# EAGLE design LED_Ansteuerung_extension (EAGLE 5.09)
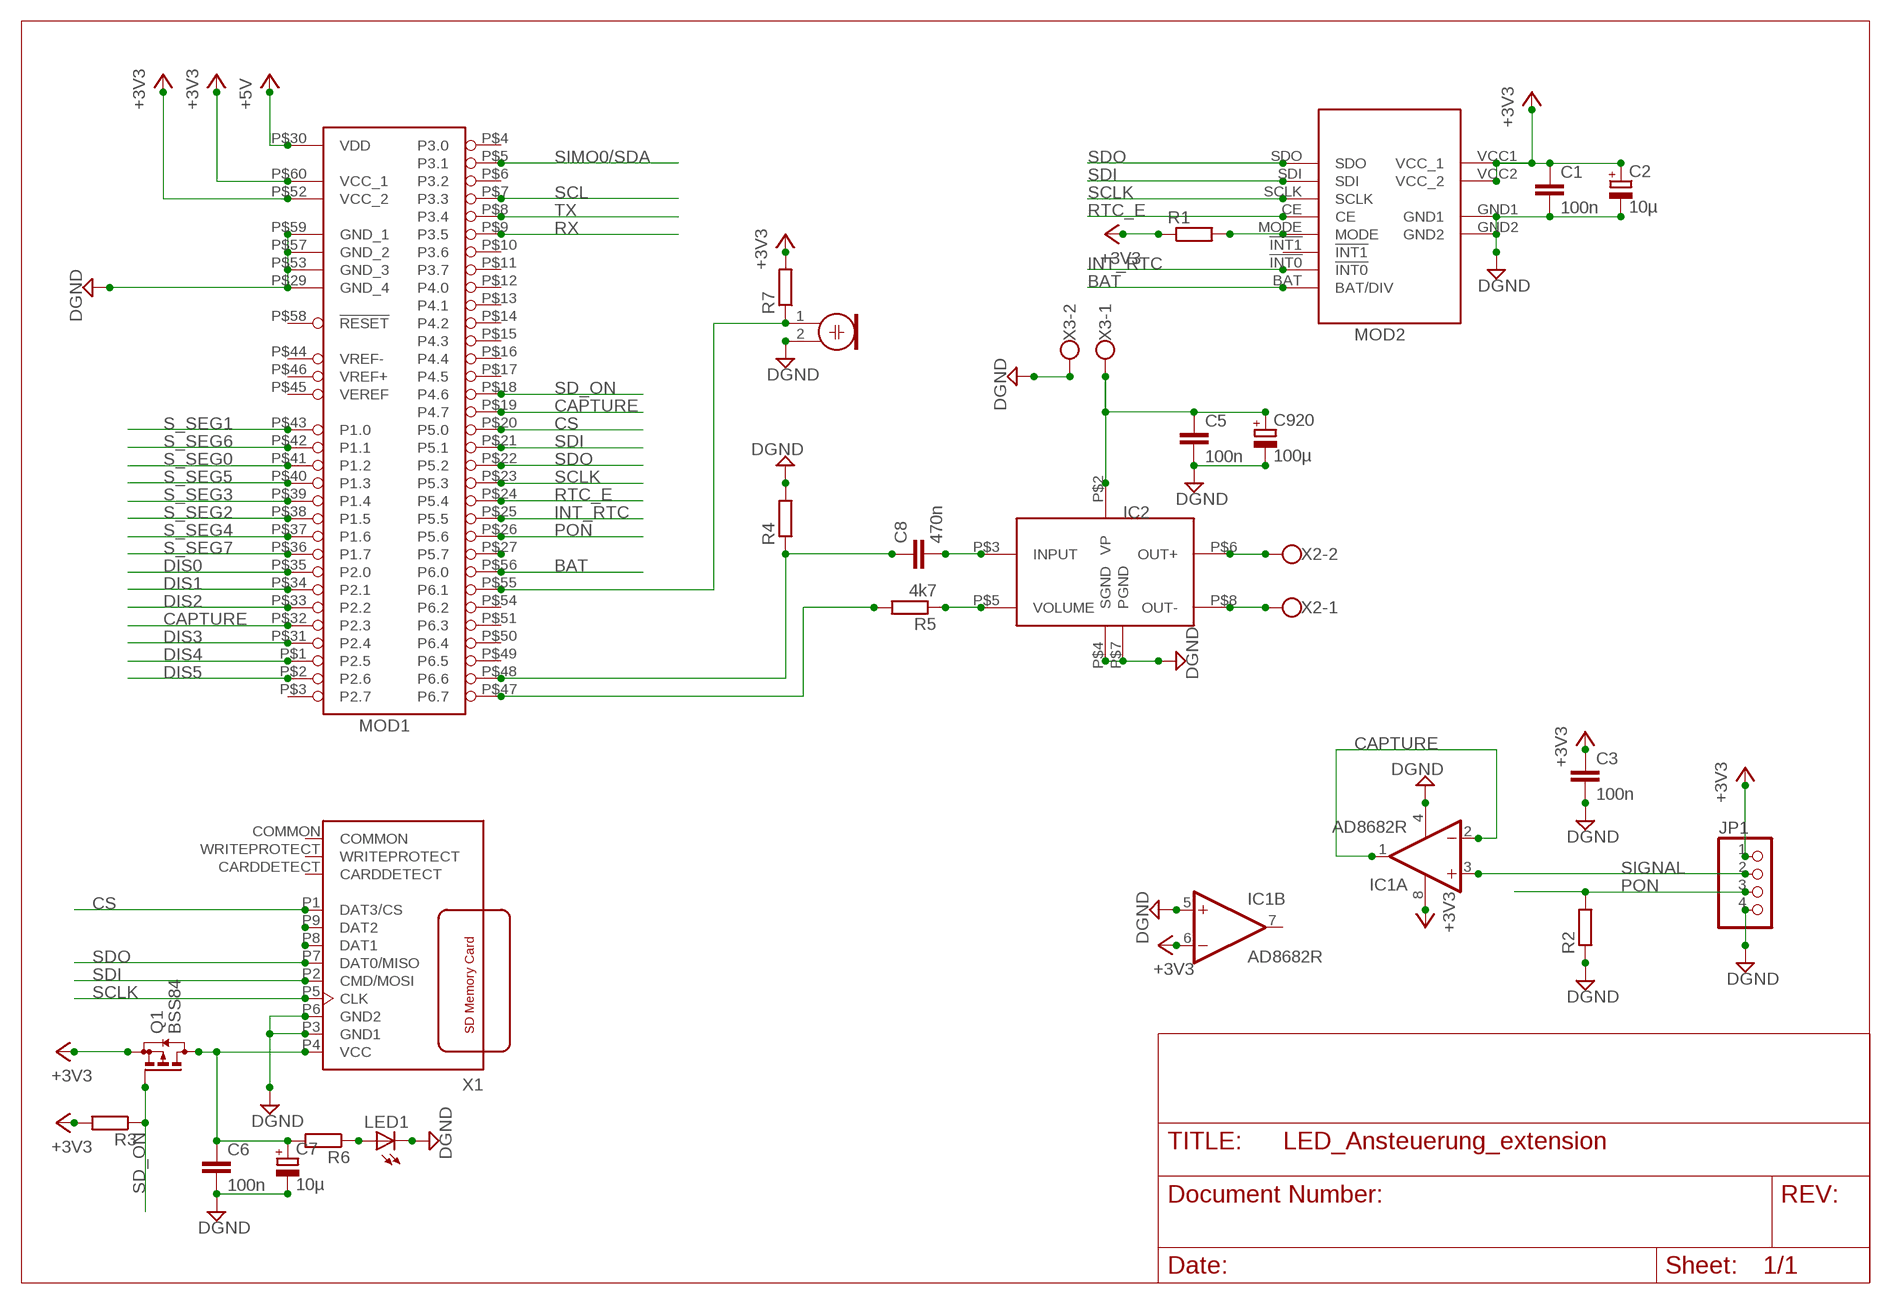
[diagram p0: schematic, sheet 1]

## Parts
C1  100n  C-EUC0603  [C0603]
C2  10µ  CPOL-EU153CLV-0505  [153CLV-0505]
C3  100n  C-EUC0603  [C0603]
C5  100n  C-EUC0603  [C0603]
C6  100n  C-EUC0603  [C0603]
C7  10µ  CPOL-EU153CLV-0505  [153CLV-0505]
C8  470n  C-EUC0805  [C0805]
C920  100µ  CPOL-EUSMCD  [SMC_D]
IC1  AD8682R  [SO08]
IC2  TDA7056A  [SIL09P]
JP1  PINHD-1X4  [1X04]
LED1  LEDCHIP-LED0603  [CHIP-LED0603]
M1  ELECTRET_MICROPHON-WM.64PN  [WM-64PN]
MOD1  MOD_MSP430F16X  [MOD_MSDP430F16X]
MOD2  DS1305_MOD  [DS1305_MOD]
Q1  BSS84  [SOT23]
R1  R-EU_R1206  [R1206]
R2  R-EU_R1206  [R1206]
R3  R-EU_R1206  [R1206]
R4  R-EU_R0603  [R0603]
R5  4k7  R-EU_R0805  [R0805]
R6  R-EU_R1206  [R1206]
R7  R-EU_R0603  [R0603]
X1  FPS009-2  [FPS009-2]
X2  W237-02P  [W237-132]
X3  W237-02P  [W237-132]

## Nets
+3V3: C1.1 C2.+ C3.1 IC1.6(B:-IN) IC1.8(P:V+) JP1.1 MOD1.P$52(VCC_2) MOD1.P$60(VCC_1) MOD2.VCC1(VCC_1) MOD2.VCC2(VCC_2) Q1.2(S) R1.1 R3.2 R7.2
+5V: MOD1.P$30(VDD)
BAT: MOD1.P$56(P6.0) MOD2.BAT(BAT/DIV)
CAPTURE: IC1.1(A:OUT) IC1.2(A:-IN) MOD1.P$19(P4.7) MOD1.P$32(P2.3)
CS: MOD1.P$20(P5.0) X1.P1(DAT3/CS)
DGND: C1.2 C2.- C3.2 C5.2 C6.2 C7.- C920.- IC1.4(P:V-) IC1.5(B:+IN) IC2.P$4(SGND) IC2.P$7(PGND) JP1.4 LED1.C M1.2 MOD1.P$29(GND_4) MOD1.P$53(GND_3) MOD1.P$57(GND_2) MOD1.P$59(GND_1) MOD2.GND1 MOD2.GND2 R2.1 R4.2 X1.P3(GND1) X1.P6(GND2) X3.2
DIS0: MOD1.P$35(P2.0)
DIS1: MOD1.P$34(P2.1)
DIS2: MOD1.P$33(P2.2)
DIS3: MOD1.P$31(P2.4)
DIS4: MOD1.P$1(P2.5)
DIS5: MOD1.P$2(P2.6)
INT_RTC: MOD1.P$25(P5.5) MOD2.!INT0
N$1: MOD2.MODE R1.2
N$2: C5.1 C920.+ IC2.P$2(VP) X3.1
N$3: C6.1 C7.+ Q1.3(D) R6.2 X1.P4(VCC)
N$4: IC2.P$8(OUT-) X2.1
N$5: IC2.P$6(OUT+) X2.2
N$6: C8.2 IC2.P$3(INPUT)
N$7: X1.P8(DAT1)
N$8: X1.P9(DAT2)
N$9: C8.1 MOD1.P$48(P6.6) R4.1
N$10: IC2.P$5(VOLUME) R5.1
N$11: MOD1.P$47(P6.7) R5.2
N$12: LED1.A R6.1
N$13: M1.1 MOD1.P$55(P6.1) R7.1
N$15: MOD1.P$27(P5.7)
PON: JP1.3 MOD1.P$26(P5.6) R2.2
RTC_E: MOD1.P$24(P5.4) MOD2.CE
RX: MOD1.P$9(P3.5)
S_SEG0: MOD1.P$41(P1.2)
S_SEG1: MOD1.P$43(P1.0)
S_SEG2: MOD1.P$38(P1.5)
S_SEG3: MOD1.P$39(P1.4)
S_SEG4: MOD1.P$37(P1.6)
S_SEG5: MOD1.P$40(P1.3)
S_SEG6: MOD1.P$42(P1.1)
S_SEG7: MOD1.P$36(P1.7)
SCL: MOD1.P$7(P3.3)
SCLK: MOD1.P$23(P5.3) MOD2.SCLK X1.P5(CLK)
SD_ON: MOD1.P$18(P4.6) Q1.1(G) R3.1
SDI: MOD1.P$21(P5.1) MOD2.SDI X1.P2(CMD/MOSI)
SDO: MOD1.P$22(P5.2) MOD2.SDO X1.P7(DAT0/MISO)
SIGNAL: IC1.3(A:+IN) JP1.2
SIMO0/SDA: MOD1.P$5(P3.1)
TX: MOD1.P$8(P3.4)
Unconnected: IC1.7(B:OUT) MOD1.P$3(P2.7) MOD1.P$4(P3.0) MOD1.P$6(P3.2) MOD1.P$10(P3.6) MOD1.P$11(P3.7) MOD1.P$12(P4.0) MOD1.P$13(P4.1) MOD1.P$14(P4.2) MOD1.P$15(P4.3) MOD1.P$16(P4.4) MOD1.P$17(P4.5) MOD1.P$44(VREF-) MOD1.P$45(VEREF) MOD1.P$46(VREF+) MOD1.P$49(P6.5) MOD1.P$50(P6.4) MOD1.P$51(P6.3) MOD1.P$54(P6.2) MOD1.P$58(!RESET) MOD2.!INT1 X1.CARDDETECT X1.COMMON X1.WRITEPROTECT

## Library data of the parts
C1 C3 C5 C6 C8 = rcl:C-EU: CAPACITOR, European symbol
C2 C7 C920 = rcl:CPOL-EU: POLARIZED CAPACITOR, European symbol
IC1 = linear:AD8682: Dual Low Power, High Speed JFET Operational Amplifiers Source: http://www.analog.com/UploadedFiles/Data_Sheets/AD8682_8684.pdf
IC2 = extra_dev:TDA7056A
JP1 = pinhead:PINHD-1X4: PIN HEADER
LED1 = led:LED: LED OSRAM: - CHIPLED LG R971, LG N971, LY N971, LG Q971, LY Q971, LO R971, LY R971 LH N974, LH R974 LS Q976, LO Q976, LY Q976 LO Q996 - Hyper CHIPLED LW Q18S LB Q993, LB Q99A, LB R99A - SideLED LS A670, LO A670, LY A670, LG A670, LP A670 LB A673, LV A673, LT A673, LW A673 LH A674 LY A675 LS A676, LA A676, LO A676, LY A676, LW A676 LS A679, LY A679, LG A679 - Hyper Micro SIDELED® LS Y876, LA Y876, LO Y876, LY Y876 LT Y87S - SmartLED LW L88C, LW L88S LB L89C, LB L89S, LG L890 LS L89K, LO L89K, LY L89K LS L896, LA L896, LO L896, LY L896 - TOPLED LS T670, LO T670, LY T670, LG T670, LP T670 LSG T670, LSP T670, LSY T670, LOP T670, LYG T670 LG T671, LOG T671, LSG T671 LB T673, LV T673, LT T673, LW T673 LH T674 LS T676, LA T676, LO T676, LY T676, LB T676, LH T676, LSB T676, LW T676 LB T67C, LV T67C, LT T67C, LS T67K, LO T67K, LY T67K, LW E67C LS E67B, LA E67B, LO E67B, LY E67B, LB E67C, LV E67C, LT E67C LW T67C LS T679, LY T679, LG T679 LS T770, LO T770, LY T770, LG T770, LP T770 LB T773, LV T773, LT T773, LW T773 LH T774 LS E675, LA E675, LY E675, LS T675 LS T776, LA T776, LO T776, LY T776, LB T776 LHGB T686 LT T68C, LB T68C - Hyper Mini TOPLED® LB M676 - Mini TOPLED Santana® LG M470 LS M47K, LO M47K, LY M47K Source: http://www.osram.convergy.de LUXEON: - LUMILED® LXK2-PW12-R00, LXK2-PW12-S00, LXK2-PW14-U00, LXK2-PW14-V00 LXK2-PM12-R00, LXK2-PM12-S00, LXK2-PM14-U00 LXK2-PE12-Q00, LXK2-PE12-R00, LXK2-PE12-S00, LXK2-PE14-T00, LXK2-PE14-U00 LXK2-PB12-K00, LXK2-PB12-L00, LXK2-PB12-M00, LXK2-PB14-N00, LXK2-PB14-P00, LXK2-PB14-Q00 LXK2-PR12-L00, LXK2-PR12-M00, LXK2-PR14-Q00, LXK2-PR14-R00 LXK2-PD12-Q00, LXK2-PD12-R00, LXK2-PD12-S00 LXK2-PH12-R00, LXK2-PH12-S00 LXK2-PL12-P00, LXK2-PL12-Q00, LXK2-PL12-R00 Source: www.luxeon.com KINGBRIGHT: KA-3528ASYC Source: www.kingbright.com
M1 = microphon:ELECTRET_MICROPHON-: Electret Condenser Microphone
MOD1 = extra_dev:MOD_MSP430F16X
MOD2 = extra_dev:DS1305_MOD
Q1 = transistor-small-signal:BSS84: P-CHANNEL MOS FET
R1-R7 = rcl:R-EU_: RESISTOR, European symbol
X1 = extra_dev:FPS009-2
X2 X3 = con-wago-508:W237-02P: WAGO SREW CLAMP

## Net classes
0 default: clearance 0.25 mm

## Board
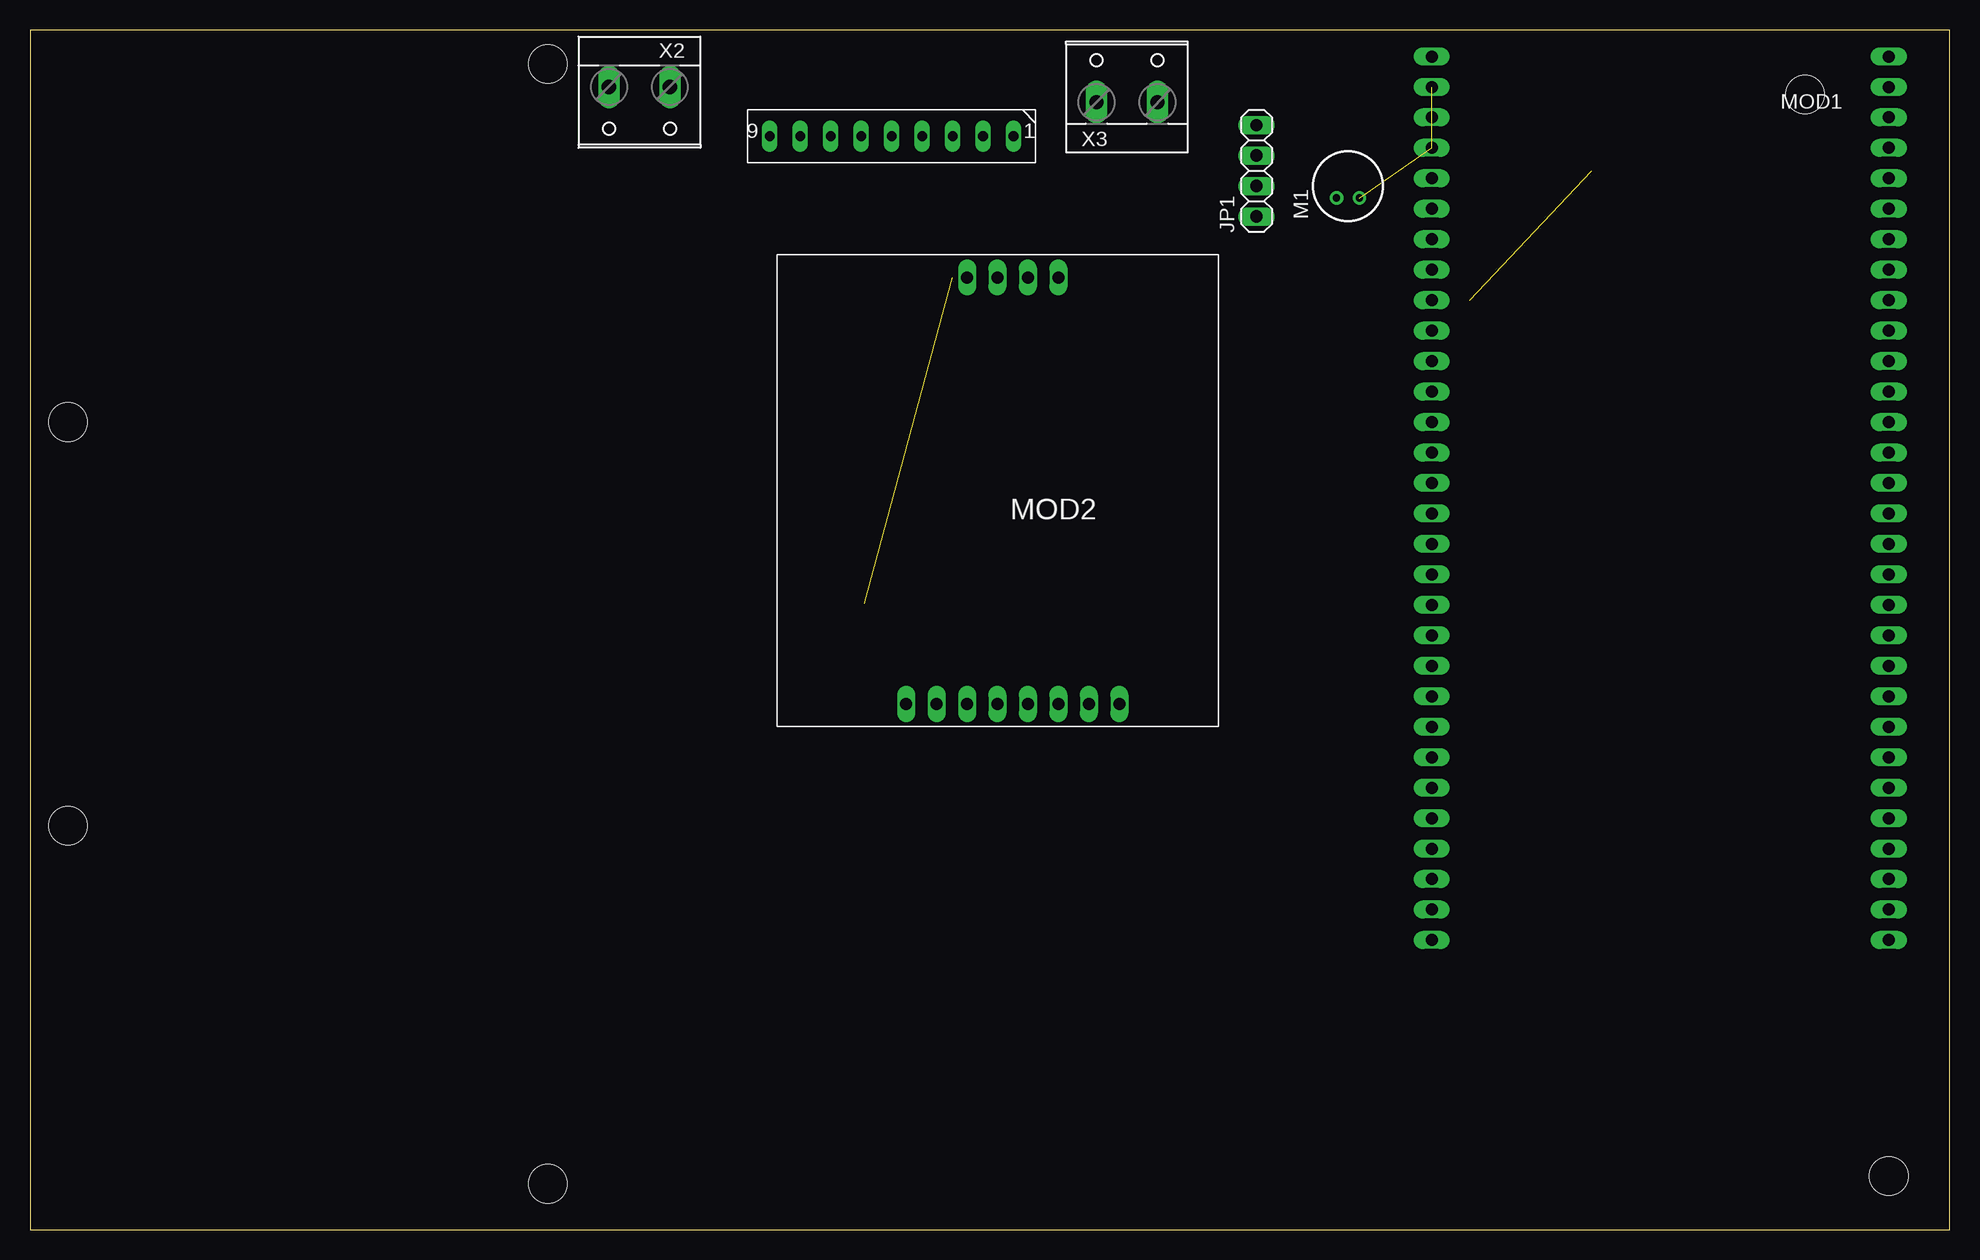
[diagram p1: board, top side]
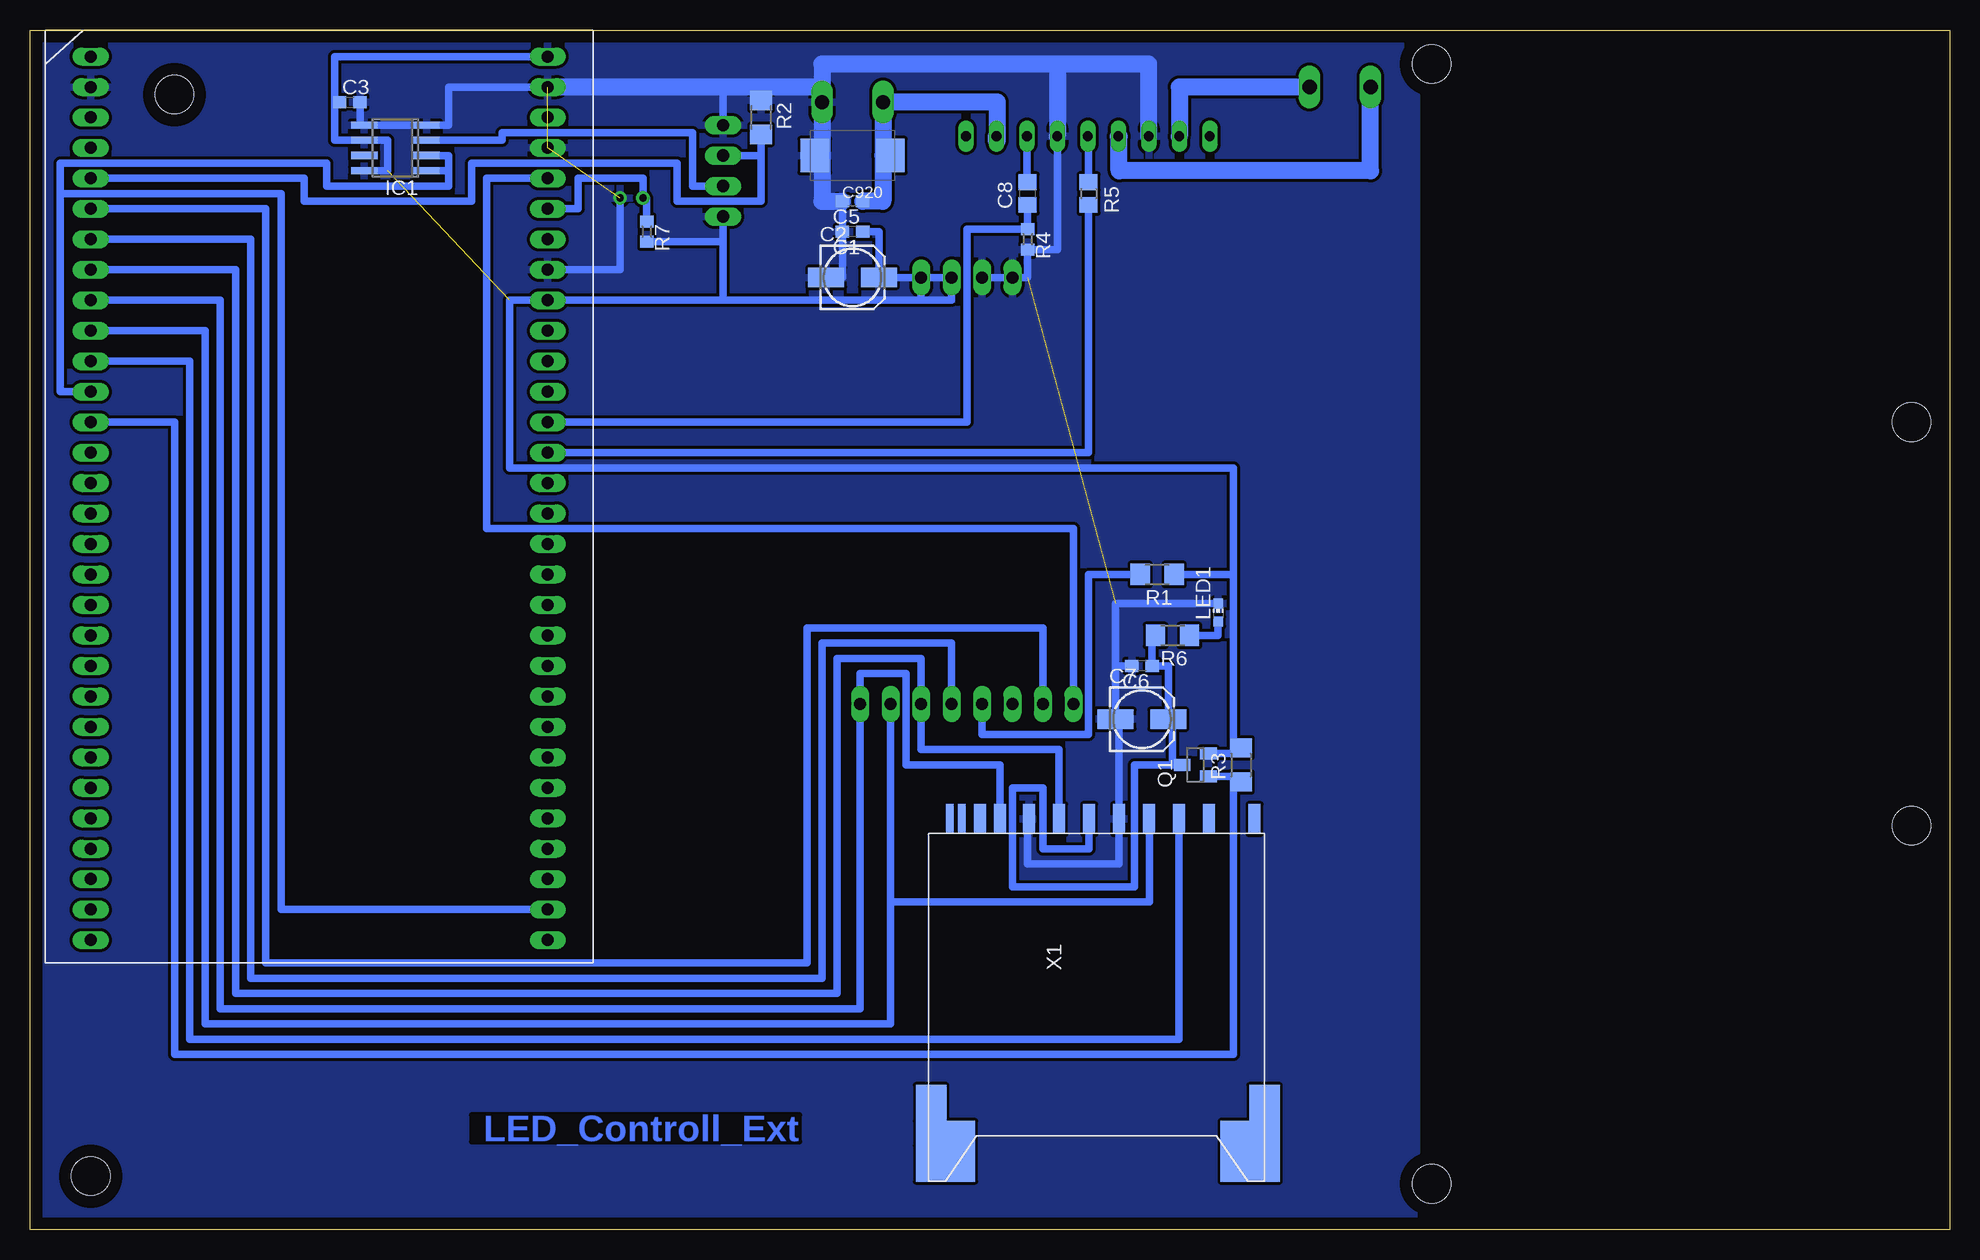
[diagram p2: board, bottom side, seen from below]

Size 160 x 100 mm. Coordinates in mm from the lower left corner, seen from the top.
Outline: 0,0 160,0 160,100 0,100 0,0
Copper layers (1*16): Top 0.035mm / dielectric 1.5mm / Bottom 0.035mm
Design rules "default": minimum track width 10mil, minimum drill 24mil, track to track 8mil, track to pad 8mil, pad to pad 8mil, via to via 8mil, smd to smd 8mil, copper to edge 40mil, drill to drill 8mil, minimum pad ring 10mil, minimum via ring 8mil, stop-mask expansion 4mil, vias tented up to drill 0mil, thermal gap 10mil
Holes 3.2 mm at 43.18,97.16 43.18,3.81 154.94,4.45 147.96,94.61 3.17,33.66 3.17,67.31

### Footprints (pad centres in the part's own frame; a part is rotated, then mirrored left to right if it is on the bottom)
C0603 = smd 1.1 x 1: 1 -0.85,0; 2 0.85,0
153CLV-0505 = smd 3 x 1.6: + 2.2,0; - -2.2,0
C0805 = smd 1.3 x 1.5: 1 -0.95,0; 2 0.95,0
SMC_D = smd 2.4 x 2.8: + -3.15,0; - 3.15,0
SO08 = smd 0.6 x 2.2: 1 -1.905,-2.6; 2 -0.635,-2.6; 3 0.635,-2.6; 4 1.905,-2.6; 5 1.905,2.6; 6 0.635,2.6; 7 -0.635,2.6; 8 -1.905,2.6
SIL09P = drill 0.8 long: P$1 1.84,2.2; P$2 4.38,2.2; P$3 6.92,2.2; P$4 9.46,2.2; P$5 12,2.2; P$6 14.54,2.2; P$7 17.08,2.2; P$8 19.62,2.2; P$9 22.16,2.2
1X04 = drill 1.016 long: 1 -3.81,0; 2 -1.27,0; 3 1.27,0; 4 3.81,0
CHIP-LED0603 = smd 0.8 x 0.8: A 0,-0.75; C 0,0.75
WM-64PN = drill 0.6 pad 1 round: 1 -1,0.95; 2 -1,-0.95
MOD_MSDP430F16X = drill 1 pad 1.422 long: P$1 41.91,1.905; P$2 41.91,4.445; P$3 41.91,6.985; P$4 41.91,9.525; P$5 41.91,12.065; P$6 41.91,14.605; P$7 41.91,17.145; P$8 41.91,19.685; P$9 41.91,22.225; P$10 41.91,24.765; P$11 41.91,27.305; P$12 41.91,29.845; P$13 41.91,32.385; P$14 41.91,34.925; P$15 41.91,37.465; P$16 41.91,40.005; P$17 41.91,42.545; P$18 41.91,45.085; P$19 41.91,47.625; P$20 41.91,50.165; P$21 41.91,52.705; P$22 41.91,55.245; P$23 41.91,57.785; P$24 41.91,60.325; P$25 41.91,62.865; P$26 41.91,65.405; P$27 41.91,67.945; P$28 41.91,70.485; P$29 41.91,73.025; P$30 41.91,75.565; P$31 3.81,1.905; P$32 3.81,4.445; P$33 3.81,6.985; P$34 3.81,9.525; P$35 3.81,12.065; P$36 3.81,14.605; P$37 3.81,17.145; P$38 3.81,19.685; P$39 3.81,22.225; P$40 3.81,24.765; P$41 3.81,27.305; P$42 3.81,29.845; P$43 3.81,32.385; P$44 3.81,34.925; P$45 3.81,37.465; P$46 3.81,40.005; P$47 3.81,42.545; P$48 3.81,45.085; P$49 3.81,47.625; P$50 3.81,50.165; P$51 3.81,52.705; P$52 3.81,55.245; P$53 3.81,57.785; P$54 3.81,60.325; P$55 3.81,62.865; P$56 3.81,65.405; P$57 3.81,67.945; P$58 3.81,70.485; P$59 3.81,73.025; P$60 3.81,75.565
DS1305_MOD = drill 1 long: !INT0 23.495,37.465; !INT1 20.955,37.465; BAT 26.035,37.465; CE 15.875,37.465; GND1 18.415,1.905; GND2 20.955,1.905; MODE 18.415,37.465; SCLK 13.335,37.465; SDI 10.795,37.465; SDO 8.255,37.465; VCC1 13.335,1.905; VCC2 15.875,1.905
SOT23 = smd 1 x 1.4: 1 -0.95,-1.1; 2 0.95,-1.1; 3 0,1.1
R1206 = smd 1.6 x 1.803: 1 -1.422,0; 2 1.422,0
R0603 = smd 1 x 1.1: 1 -0.85,0; 2 0.85,0
R0805 = smd 1.3 x 1.5: 1 -0.95,0; 2 0.95,0
FPS009-2 = smd 2.5 x 0.65: CARDDETECT -1.2,2.76; COMMON -1.2,1.76 | smd 2.5 x 1: P1 -1.2,20.88; P2 -1.2,18.38; P3 -1.2,15.88; P4 -1.2,13.38; P5 -1.2,10.88; P6 -1.2,8.38; P7 -1.2,5.95; P8 -1.2,4.26; P9 -1.2,23.38; SW -1.2,27.16 | smd 5.08 x 2.54: P$11 23.5,0.2; P$12 23.5,28; P$14 26.5,0.2; P$15 26.5,28; P$17 26.5,25.6; WRITEPROTECT 26.5,2.6
W237-132 = drill 1.194 long: 1 -2.54,-0.635; 2 2.54,-0.635

### Placement (x,y rotation side)
C1  91.44,83.19 180 bottom
C2  91.44,79.38 0 bottom
C3  133.35,93.98 0 bottom
C5  91.44,85.72 180 bottom
C6  67.31,46.99 180 bottom
C7  67.31,42.55 0 bottom
C8  76.83,86.36 90 bottom
C920  91.44,89.53 180 bottom
IC1  129.54,90.17 90 bottom
IC2  83.82,93.34 180 top
JP1  102.23,88.27 90 top
LED1  60.96,51.44 0 bottom
M1  109.86,87 90 top
MOD1  113.03,22.23 0 top
MOD2  99.06,81.28 180 top
Q1  62.87,38.73 90 bottom
R1  66.04,54.61 180 bottom
R2  99.06,92.71 270 bottom
R3  59.05,38.73 90 bottom
R4  76.83,82.55 270 bottom
R5  71.75,86.36 270 bottom
R6  64.77,49.53 180 bottom
R7  108.58,83.19 270 bottom
X1  85.09,33.02 270 bottom
X2  50.8,94.61 180 top
X3  91.44,94.61 0 top

### Tracks (layer width: path | path; a pad name or v marks a point on that pad's centre or on a via)
+3V3  (1 unrouted)
  Bottom 0.61: MOD2.VCC1 MOD2.VCC2 83.19,77.47 85.72,77.47 | 102.23,77.47 MOD1.P$52 120.02,77.47 120.02,63.5 59.69,63.5 59.69,54.61 | 102.23,77.47 85.72,77.47 | 85.72,77.47 MOD2.VCC1 | 59.69,54.61 59.69,39.69 Q1.2 59.05,39.69 R3.2 | IC1.8 130.18,88.27 130.18,90.81 IC1.6 134.62,90.81 134.62,93.98 | MOD1.P$60 134.62,97.79 134.62,93.98 | 102.23,77.47 JP1.1 102.23,82.33 R7.2 | MOD2.VCC1 C2.+ 89.24,83.19 C1.1 | 134.62,93.98 C3.1 | 59.69,54.61 R1.1
  pour Bottom (rank 2): 44.45,0 160.02,0 160.02,69.22 160.02,100.33 44.45,100.33
BAT
  Bottom 0.61: MOD2.BAT 73.03,58.42 121.92,58.42 121.92,87.63 MOD1.P$56
CAPTURE
  Bottom 0.61: MOD1.P$19 157.48,69.85 157.48,86.36 | MOD1.P$32 139.06,26.67 139.06,86.36 157.48,86.36 | 157.48,86.36 157.48,88.9 135.25,88.9 135.25,87 125.09,87 125.09,88.27 | 125.09,88.27 IC1.1 | IC1.2 125.09,89.53 125.09,88.27
CS
  Bottom 0.61: MOD1.P$20 146.69,72.39 146.69,15.88 64.21,15.88 X1.P1
DGND  (3 unrouted)
  Bottom 0.61: X1.P6 76.83,34.22 76.83,30.48 69.21,30.48 X1.P3 69.21,42.55 C7.- 69.51,46.99 | IC2.P$4 74.36,81.7 R4.2 76.83,79.38 MOD2.GND2 MOD2.GND1 | MOD1.P$59 125.09,95.25 125.09,92.08 IC1.4 IC1.5 132.5,92.08 C3.2 | 102.23,95.25 JP1.4 | M1.2 110.81,80.01 MOD1.P$53 | C2.- 92.29,79.38 C1.2 C5.2 | 69.51,46.99 C6.2 | LED1.C 69.51,52.19 69.51,46.99 | 99.06,95.25 R2.1
  Bottom 1.422: 93.98,89.53 C920.- | 93.98,89.53 X3.2 93.98,95.25 | C5.2 93.98,85.72 93.98,89.53 | 74.36,97.16 IC2.P$4 | 74.36,97.16 93.98,97.16 93.98,95.25 | 93.98,95.25 99.06,95.25 102.23,95.25 MOD1.P$59 | IC2.P$7 66.74,97.16 74.36,97.16
  pour Bottom: 44.45,100.33 44.45,0 160.02,0 160.02,100.33
INT_RTC
  Bottom 0.61: MOD2.!INT0 75.56,50.16 95.25,50.16 95.25,22.23 140.34,22.23 140.34,85.09 MOD1.P$25
N$1
  Bottom 0.61: MOD2.MODE 80.64,41.27 71.75,41.27 71.75,54.61 R1.2
N$2
  Bottom 1.422: IC2.P$2 79.44,90.81 79.38,90.81 79.38,93.98 X3.1 88.9,89.53 | 88.9,89.53 C920.+ | C5.1 88.9,85.72 88.9,89.53
N$3
  Bottom 0.61: 64.77,38.73 67.94,38.73 67.94,28.57 78.11,28.57 78.11,36.83 75.56,36.83 75.56,31.75 71.71,31.75 X1.P4 | 64.77,38.73 Q1.3 | 64.77,38.73 64.77,42.55 C7.+ 65.11,46.99 C6.1 66.46,49.53 R6.2
N$4
  Bottom 1.422: X2.1 64.2,95.25 IC2.P$8
N$5
  Bottom 1.422: X2.2 48.26,88.27 69.22,88.27 69.22,91.14 IC2.P$6
N$6
  Bottom 0.61: IC2.P$3 76.9,87.31 C8.2
N$9
  Bottom 0.61: C8.1 R4.1 81.92,83.4 81.92,67.31 MOD1.P$48
N$10
  Bottom 0.61: R5.1 71.75,91.14 IC2.P$5
N$11
  Bottom 0.61: R5.2 71.75,64.77 MOD1.P$47 117.47,64.77
N$12
  Bottom 0.61: LED1.A 60.96,49.53 R6.1
N$13
  Bottom 0.61: R7.1 108.58,86 M1.1 108.91,87.63 114.3,87.63 114.3,85.09 MOD1.P$55
PON
  Bottom 0.61: 99.06,89.53 JP1.3 | 99.06,89.53 99.06,85.72 106.05,85.72 106.05,88.9 123.19,88.9 123.19,85.72 137.16,85.72 137.16,87.63 MOD1.P$26 | 99.06,89.53 R2.2
RTC_E
  Bottom 0.61: MOD2.CE 83.19,48.9 93.98,48.9 93.98,20.95 141.6,20.95 141.6,82.55 MOD1.P$24
SCLK
  Bottom 0.61: MOD1.P$23 142.88,80.01 142.88,19.68 92.71,19.68 92.71,47.62 85.72,47.62 MOD2.SCLK 85.72,40.01 74.21,40.01 X1.P5
SD_ON
  Bottom 0.61: MOD1.P$18 147.96,67.31 147.96,14.61 59.69,14.61 59.69,37.78 Q1.1 59.05,37.78 R3.1
SDI
  Bottom 0.61: MOD1.P$21 145.41,74.93 145.41,17.14 88.27,17.14 88.27,27.3 | 88.27,27.3 MOD2.SDI | 88.27,27.3 66.67,27.3 66.67,34.22 X1.P2
SDO
  Bottom 0.61: MOD1.P$22 144.15,77.47 144.15,18.41 90.81,18.41 MOD2.SDO 90.81,46.35 87,46.35 87,38.73 79.14,38.73 X1.P7
SIGNAL
  Bottom 0.61: 101.6,87 JP1.2 104.78,87 104.78,91.44 120.65,91.44 120.65,90.81 IC1.3

### Text on the board
Bottom: LED_Controll_Ext